# EAGLE design quadcopter (EAGLE 7.6.0)
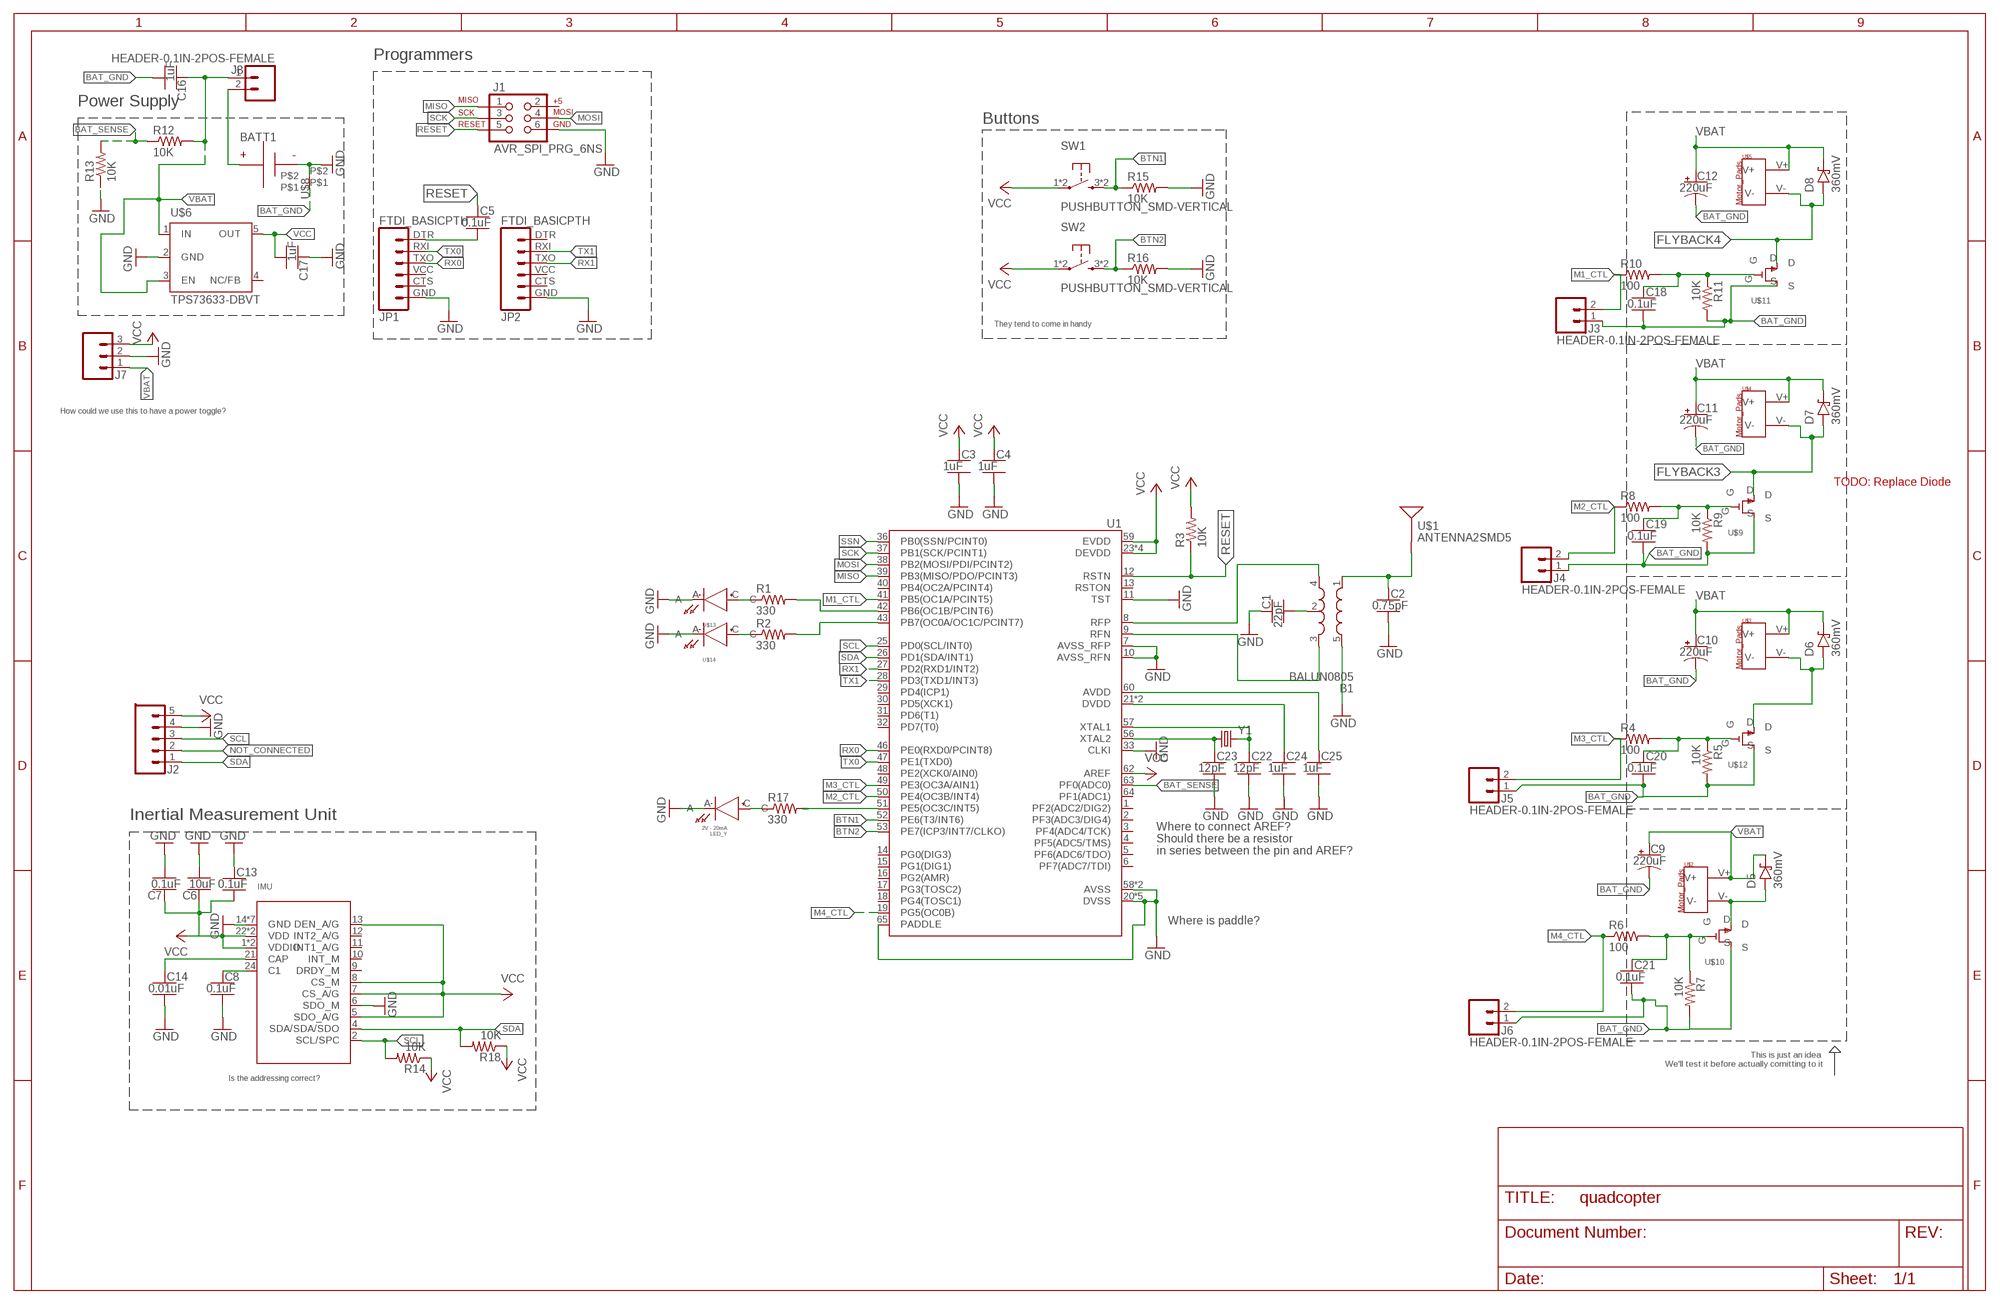
[diagram p0: schematic, sheet 1]

## Parts
B1  BALUN0805  [BALUN]
BATT1  BATTERY-HUBSAN-W/HOLDER  [BATTERY-W/HOLDER-380MAH-HUBSAN]
C1  22pF  CAPACITOR-NP_SMD-2012-0805_CERAMIC-22PF  [CAPC2012X140_HS]
C2  0.75pF  CAPACITOR-NP_SMD-2012-0805_CERAMIC-0.75PF  [CAPC2012X140_HS]
C3  1uF  CAPACITOR-NP_SMD-2012-0805_CERAMIC-1UF  [CAPC2012X140_HS]
C4  1uF  CAPACITOR-NP_SMD-2012-0805_CERAMIC-1UF  [CAPC2012X140_HS]
C5  0.1uF  CAPACITOR-NP_SMD-2012-0805_CERAMIC-0.1UF  [CAPC2012X140_HS]
C6  10uF  CAPACITOR-NP_SMD-2012-0805_CERAMIC-10UF  [CAPC2012X140_HS]
C7  0.1uF  CAPACITOR-NP_SMD-2012-0805_CERAMIC-0.1UF  [CAPC2012X140_HS]
C8  0.1uF  CAPACITOR-NP_SMD-2012-0805_CERAMIC-0.1UF  [CAPC2012X140_HS]
C9  220uF  CAPACITOR-POL_SMD-7043-D_TANTALUM-220UF  [CAPMP7343X310_HS]
C10  220uF  CAPACITOR-POL_SMD-7043-D_TANTALUM-220UF  [CAPMP7343X310_HS]
C11  220uF  CAPACITOR-POL_SMD-7043-D_TANTALUM-220UF  [CAPMP7343X310_HS]
C12  220uF  CAPACITOR-POL_SMD-7043-D_TANTALUM-220UF  [CAPMP7343X310_HS]
C13  0.1uF  CAPACITOR-NP_SMD-2012-0805_CERAMIC-0.1UF  [CAPC2012X140_HS]
C14  0.01uF  CAPACITOR-NP_SMD-2012-0805_CERAMIC-0.01UF  [CAPC2012X140_HS]
C16  1uF  CAPACITOR-NP_SMD-2012-0805_CERAMIC-1UF  [CAPC2012X140_HS]
C17  1uF  CAPACITOR-NP_SMD-2012-0805_CERAMIC-1UF  [CAPC2012X140_HS]
C18  0.1uF  CAPACITOR-NP_SMD-2012-0805_CERAMIC-0.1UF  [CAPC2012X140_HS]
C19  0.1uF  CAPACITOR-NP_SMD-2012-0805_CERAMIC-0.1UF  [CAPC2012X140_HS]
C20  0.1uF  CAPACITOR-NP_SMD-2012-0805_CERAMIC-0.1UF  [CAPC2012X140_HS]
C21  0.1uF  CAPACITOR-NP_SMD-2012-0805_CERAMIC-0.1UF  [CAPC2012X140_HS]
C22  12pF  CAPACITOR-NP_SMD-2012-0805_CERAMIC-12PF  [CAPC2012X140_HS]
C23  12pF  CAPACITOR-NP_SMD-2012-0805_CERAMIC-12PF  [CAPC2012X140_HS]
C24  1uF  CAPACITOR-NP_SMD-2012-0805_CERAMIC-1UF  [CAPC2012X140_HS]
C25  1uF  CAPACITOR-NP_SMD-2012-0805_CERAMIC-1UF  [CAPC2012X140_HS]
D5  360mV  DIODE-SCHOTTKY_SMD-SOD123-360MV  [SOD3716X135_HS]
D6  360mV  DIODE-SCHOTTKY_SMD-SOD123-360MV  [SOD3716X135_HS]
D7  360mV  DIODE-SCHOTTKY_SMD-SOD123-360MV  [SOD3716X135_HS]
D8  360mV  DIODE-SCHOTTKY_SMD-SOD123-360MV  [SOD3716X135_HS]
IMU  IMU  [IMU_LSM9DS1TR]
J1  AVR_SPI_PRG_6NS  [2X3-NS]
J2  HEADER-0.1IN-5POS-FEMALE  [HDRV5W63P254_5X1_1270X254H838_HS]
J3  HEADER-0.1IN-2POS-FEMALE  [HDRV2W63P254_2X1_508X254H838_HS]
J4  HEADER-0.1IN-2POS-FEMALE  [HDRV2W63P254_2X1_508X254H838_HS]
J5  HEADER-0.1IN-2POS-FEMALE  [HDRV2W63P254_2X1_508X254H838_HS]
J6  HEADER-0.1IN-2POS-FEMALE  [HDRV2W63P254_2X1_508X254H838_HS]
J7  HEADER-0.1IN-3POS-MALE  [HDRV3W63P254_3X1_762X254H838_HS]
J8  HEADER-0.1IN-2POS-FEMALE  [HDRV2W63P254_2X1_508X254H838_HS]
JP1  FTDI_BASICPTH  [FTDI_BASIC]
JP2  FTDI_BASICPTH  [FTDI_BASIC]
LED_Y  2V - 20mA  LEDCMD17  [LED_LTST-C170EKT]
R1  330  RESISTOR_SMD-2012-0805-330  [RESC2012X60_HS]
R2  330  RESISTOR_SMD-2012-0805-330  [RESC2012X60_HS]
R3  10K  RESISTOR_SMD-2012-0805-10K  [RESC2012X60_HS]
R4  100  RESISTOR_SMD-2012-0805-100  [RESC2012X60_HS]
R5  10K  RESISTOR_SMD-2012-0805-10K  [RESC2012X60_HS]
R6  100  RESISTOR_SMD-2012-0805-100  [RESC2012X60_HS]
R7  10K  RESISTOR_SMD-2012-0805-10K  [RESC2012X60_HS]
R8  100  RESISTOR_SMD-2012-0805-100  [RESC2012X60_HS]
R9  10K  RESISTOR_SMD-2012-0805-10K  [RESC2012X60_HS]
R10  100  RESISTOR_SMD-2012-0805-100  [RESC2012X60_HS]
R11  10K  RESISTOR_SMD-2012-0805-10K  [RESC2012X60_HS]
R12  10K  RESISTOR_SMD-2012-0805-10K  [RESC2012X60_HS]
R13  10K  RESISTOR_SMD-2012-0805-10K  [RESC2012X60_HS]
R14  10K  RESISTOR_SMD-2012-0805-10K  [RESC2012X60_HS]
R15  10K  RESISTOR_SMD-2012-0805-10K  [RESC2012X60_HS]
R16  10K  RESISTOR_SMD-2012-0805-10K  [RESC2012X60_HS]
R17  330  RESISTOR_SMD-2012-0805-330  [RESC2012X60_HS]
R18  10K  RESISTOR_SMD-2012-0805-10K  [RESC2012X60_HS]
SW1  PUSHBUTTON_SMD-VERTICAL  [TE_FSM8JSMA_HS]
SW2  PUSHBUTTON_SMD-VERTICAL  [TE_FSM8JSMA_HS]
U1  ATMEGA128RFA1  [QFN-64]
U$1  ANTENNA2SMD5  [ANTENNA-CHIP5]
U$2  MOTOR_PADS  [MOTOR_PADS]
U$3  MOTOR_PADS  [MOTOR_PADS]
U$4  MOTOR_PADS  [MOTOR_PADS]
U$5  MOTOR_PADS  [MOTOR_PADS]
U$6  TPS73633-DBVT  [SOT23-DBV]
U$8  NET_BRIDGE  [NET_BRIDGE]
U$9  N-FET  [N_FET_SI2302CDS-T1-E3CT-ND]
U$10  N-FET  [N_FET_SI2302CDS-T1-E3CT-ND]
U$11  N-FET  [N_FET_SI2302CDS-T1-E3CT-ND]
U$12  N-FET  [N_FET_SI2302CDS-T1-E3CT-ND]
U$13  LED-RED  [LED_LTST-C170EKT]
U$14  LED-RED  [LED_LTST-C170EKT]
Y1  CRYSTAL5X3  [CRYSTAL-SMD-5X3]

## Nets
ATTENNA: B1.1(IN) C2.1 U$1.FEED(SIGNAL)
BAT_GND [HighAmps]: C9.2(-) C10.2(-) C11.2(-) C12.2(-) C16.2 C18.2 C19.2 C20.2 C21.2 J3.1 J4.1 J5.1 J6.1 R5.2 R7.2 R9.2 R11.2 U$8.P$1 U$9.S U$10.S U$11.S U$12.S
BAT_SENSE: R12.1 R13.2 U1.63(PF0(ADC0))
BTN1: R15.1 SW1.3 SW1.4 U1.52(PE6(T3/INT6))
BTN2: R16.1 SW2.3 SW2.4 U1.53(PE7(ICP3/INT7/CLKO))
FLYBACK2 [HighAmps]: D6.A U$3.V- U$12.D
FLYBACK3 [HighAmps]: D7.A U$4.V- U$9.D
FLYBACK4 [HighAmps]: D8.A U$5.V- U$11.D
GND: B1.5(GND) BATT1.-(N) C1.1 C2.2 C3.2 C4.2 C6.2 C7.2 C8.2 C13.1 C14.2 C17.1 C22.2 C23.2 C24.2 C25.2 IMU.6(SDO_M) IMU.14(GND) IMU.15(GND) IMU.16(GND) IMU.17(GND) IMU.18(GND) IMU.19(GND) IMU.20(GND) J1.6 J2.4 J7.2 JP1.GND JP2.GND LED_Y.A R13.1 R15.2 R16.2 U1.7(AVSS_RFP) U1.10(AVSS_RFN) U1.11(TST) U1.20(DVSS) U1.24(DVSS) U1.33(CLKI) U1.35(DVSS) U1.45(DVSS) U1.55(DVSS) U1.58(AVSS) U1.61(AVSS) U1.65(PADDLE) U$6.2(GND) U$8.P$2 U$13.A U$14.A
M1_CTL: J3.2 R10.1 U1.41(PB5(OC1A/PCINT5))
M2_CTL: J4.2 R8.1 U1.50(PE4(OC3B/INT4))
M3_CTL: J5.2 R4.1 U1.49(PE3(OC3A/AIN1))
M4_CTL: J6.2 R6.1 U1.19(PG5(OC0B))
MISO: J1.1 U1.39(PB3(MISO/PDO/PCINT3))
MOSI: J1.4 U1.38(PB2(MOSI/PDI/PCINT2))
N$1: C5.2 JP1.DTR
N$2: R2.2 U1.43(PB7(OC0A/OC1C/PCINT7))
N$3: B1.2(GND) C1.2
N$4: R1.2 U1.42(PB6(OC1B/PCINT6))
N$5: R1.1 U$13.C
N$6: R2.1 U$14.C
N$7: D5.A U$2.V- U$10.D
N$8: C20.1 R4.2 R5.1 U$12.G
N$9: C8.1 IMU.24(C1)
N$10 [HighAmps]: BATT1.+(P) J8.2
N$11: C19.1 R8.2 R9.1 U$9.G
N$12: C21.1 R6.2 R7.1 U$10.G
N$13: C18.1 R10.2 R11.1 U$11.G
N$14: C14.1 IMU.21(CAP)
N$15: C22.1 U1.57(XTAL1) Y1.3
N$17: R17.2 U1.51(PE5(OC3C/INT5))
N$18: LED_Y.C R17.1
N$19: C23.1 U1.56(XTAL2) Y1.1
N$20: C24.1 U1.21(DVDD) U1.22(DVDD)
N$21: C25.1 U1.60(AVDD)
NOT_CONNECTED: J2.2
RESET: C5.1 J1.5 R3.1 U1.12(RSTN)
RFN: B1.3(OUT2) U1.9(RFN)
RFP: B1.4(OUT1) U1.8(RFP)
RX0: JP1.TXO U1.46(PE0(RXD0/PCINT8))
RX1: JP2.TXO U1.27(PD2(RXD1/INT2))
SCK: J1.3 U1.37(PB1(SCK/PCINT1))
SCL: IMU.2(SCL/SPC) J2.3 R14.2 U1.25(PD0(SCL/INT0))
SDA: IMU.4(SDA/SDA/SDO) J2.1 R18.2 U1.26(PD1(SDA/INT1))
SSN: U1.36(PB0(SSN/PCINT0))
TX0: JP1.RXI U1.47(PE1(TXD0))
TX1: JP2.RXI U1.28(PD3(TXD1/INT3))
VBAT [HighAmps]: C9.1(+) C10.1(+) C11.1(+) C12.1(+) C16.1 D5.C D6.C D7.C D8.C J7.1 J8.1 R12.2 U$2.V+ U$3.V+ U$4.V+ U$5.V+ U$6.1(IN) U$6.3(EN)
VCC: C3.1 C4.1 C6.1 C7.1 C13.2 C17.2 IMU.1(VDDIO) IMU.3(VDDIO) IMU.5(SDO_A/G) IMU.7(CS_A/G) IMU.8(CS_M) IMU.13(DEN_A/G) IMU.22(VDD) IMU.23(VDD) J2.5 J7.3 R3.2 R14.1 R18.1 SW1.1 SW1.2 SW2.1 SW2.2 U1.23(DEVDD) U1.34(DEVDD) U1.44(DEVDD) U1.54(DEVDD) U1.59(EVDD) U1.62(AREF) U$6.5(OUT)
Unconnected: IMU.9(DRDY_M) IMU.10(INT_M) IMU.11(INT1_A/G) IMU.12(INT2_A/G) J1.2 JP1.CTS JP1.VCC JP2.CTS JP2.DTR JP2.VCC U1.1(PF2(ADC2/DIG2)) U1.2(PF3(ADC3/DIG4)) U1.3(PF4(ADC4/TCK)) U1.4(PF5(ADC5/TMS)) U1.5(PF6(ADC6/TDO)) U1.6(PF7(ADC7/TDI)) U1.13(RSTON) U1.14(PG0(DIG3)) U1.15(PG1(DIG1)) U1.16(PG2(AMR)) U1.17(PG3(TOSC2)) U1.18(PG4(TOSC1)) U1.29(PD4(ICP1)) U1.30(PD5(XCK1)) U1.31(PD6(T1)) U1.32(PD7(T0)) U1.40(PB4(OC2A/PCINT4)) U1.48(PE2(XCK0/AIN0)) U1.64(PF1(ADC1)) U$6.4(NC/FB)

## Notes on the sheet
- Programmers
- Power Supply
- Buttons
- They tend to come in handy
- How could we use this to have a power toggle?
- TODO: Replace Diode
- Inertial Measurement Unit
- Where to connect AREF?
  Should there be a resistor
  in series between the pin and AREF?
- Where is paddle?
- This is just an idea 
  We'll test it before actually comitting to it
- Is the addressing correct?

## Library data of the parts
B1 = quadparts_prebuilt:BALUN: 0805 footprint balun- Ember 351/357; DATASHEET: http://katalog.we-online.de/pbs/datasheet/748421245.pdf; DIST: Digikey; DISTPN: 732-2230-6-ND; MFR: Wurth Electronics Inc; MPN: 748421245; PRICE: 2.63
BATT1 = quadparts_prebuilt:BATTERY; CREATOR: Swanson; DIST: AMAZON; DISTPN: http://www.amazon.com/dp/B00RROB6Q4?smid=AMNTPWSAB5H0S; MFR: HUBSAN; MPN: X4-H107C-8-in-1
C1 = quadparts_prebuilt:CAPACITOR-NP_: Nonpolarized capacitor; DIST: Digikey; DISTPN: 490-5534-1-ND; MFR: Murata Electronics North America; MPN: GRM21A5C2E220JW01D
C2 = quadparts_prebuilt:CAPACITOR-NP_: Nonpolarized capacitor; DIST: Digikey; DISTPN: 490-3585-1-ND; MFR: Murata Electronics North America; MPN: GQM2195C2AR75CB01D
C3 C4 C16 C17 C24 C25 = quadparts_prebuilt:CAPACITOR-NP_: Nonpolarized capacitor; DIST: Digikey; DISTPN: 490-4736-1-ND; MFR: Murata Electronics North America; MPN: GRM21BR71H105KA12L
C5 C7 C8 C13 C18-C21 = quadparts_prebuilt:CAPACITOR-NP_: Nonpolarized capacitor; DIST: Digikey; DISTPN: 490-1666-1-ND; MFR: Murata Electronics North America; MPN: GRM21BR71H104KA01L
C6 = quadparts_prebuilt:CAPACITOR-NP_: Nonpolarized capacitor; DIST: Digikey; DISTPN: 490-5523-1-ND; MFR: Murata Electronics North America; MPN: GRM21BR61E106KA73L
C9-C12 = quadparts_prebuilt:CAPACITOR-POL_: Polarized capacitor; DIST: Digikey; DISTPN: 478-8912-1-ND; MFR: AVX Corporation; MPN: TAJD227K006RNJ
C14 = quadparts_prebuilt:CAPACITOR-NP_: Nonpolarized capacitor; DIST: Digikey; DISTPN: 490-8295-1-ND; MFR: Murata Electronics North America; MPN: GRM2195C1H103FA01D
C22 C23 = quadparts_prebuilt:CAPACITOR-NP_: Nonpolarized capacitor; DIST: Digikey; DISTPN: 490-5531-1-ND; MFR: Murata Electronics North America; MPN: GRM21A5C2E120JW01D
D5-D8 = quadparts_prebuilt:DIODE-SCHOTTKY_: Schottky diode; DIST: Digikey; DISTPN: CRS08QMCT-ND; MFR: Toshiba Semiconductor and Storage; MPN: CRS08(TE85L,Q,M)
IMU = quadparts_michael:IMU; CREATOR: Michael M. Gonzalez; DIST: Digikey; DISTPN: 497-14946-1-ND; MFR: STMicroelectronics; MPN: LSM9DS1TR
J1 = quadparts_prebuilt:AVR_SPI_PRG_6: AVR ISP 6 Pin This is the reduced ISP connector for AVR programming. Common on Arduino. This footprint will take up less PCB space and can be used with a 10-pin to 6-pin adapter such as SKU: BOB-08508; DATASHEET: http://portal.fciconnect.com/Comergent//fci/drawing/67996.pdf; DIST: Digikey; DISTPN: 609-3234-ND; MFR: Amphenol FCI; MPN: 67997-206HLF; PRICE: 0.31
J2 = Components:HEADER-0.1IN-5POS: 5 pin single inline pin header, socket, or connector; DIST: Digikey; DISTPN: S6103-ND; PIN1: 1; PIN2: 2; PIN3: 3; PIN4: 4; PIN5: 5
J3-J6 J8 = Components:HEADER-0.1IN-2POS: 2 pin single inline pin header, socket, or connector; DIST: Digikey; DISTPN: S7000-ND; PIN1: 1; PIN2: 2
J7 = Components:HEADER-0.1IN-3POS: 3 pin single inline pin header, socket, or connector; DIST: Digikey; DISTPN: 3M9448-ND; PIN1: 1; PIN2: 2; PIN3: 3
JP1 JP2 = quadparts_prebuilt:FTDI_BASIC: FTDI Basic header with labels; DATASHEET: http://portal.fciconnect.com/Comergent//fci/drawing/68015.pdf; DIST: Digikey; DISTPN: 609-3327-ND; MFR: Amphenol FCI; MPN: 68016-406HLF; PRICE: 0.33
LED_Y = quadparts_michael:LED; CREATOR: Michael M. Gonzalez; DIST: DIGIKEY; DISTPN: L62507CT-ND; MFR: Visual Communications Company - VCC; MPN: CMD17-21VYD/TR8
R1 R2 R17 = quadparts_prebuilt:RESISTOR_: Resistor; DIST: Digikey; DISTPN: 311-330ARCT-ND; MFR: Yageo; MPN: RC0805JR-07330RL
R3 R5 R7 R9 R11-R16 R18 = quadparts_prebuilt:RESISTOR_: Resistor; DIST: Digikey; DISTPN: 311-10KARCT-ND; MFR: Yageo; MPN: RC0805JR-0710KL
R4 R6 R8 R10 = quadparts_prebuilt:RESISTOR_: Resistor; DIST: Digikey; DISTPN: 311-100ARCT-ND; MFR: Yageo; MPN: RC0805JR-07100RL
SW1 SW2 = quadparts_prebuilt:PUSHBUTTON_: Pushbutton with 2 pins shorting 1 to 2 and two extra mounting pins 3 & 4
U1 = quadparts_prebuilt:ATMEGA128RFA1: ATmega128RFA1 8-bit AVR Microcontroller with Low Power 2.4GHz Transceiver for ZigBee and IEEE 802.15.4; CREATOR: Swanson; DATASHEET: http://www.atmel.com/Images/Atmel-8266-MCU_Wireless-ATmega128RFA1_Datasheet.pdf; DIST: Digikey; DISTPN: ATMEGA128RFA1-ZUR00DKR-ND; MFR: Atmel; MPN: ATMEGA128RFA1-ZUR00; PRICE: 10.21
U$1 = quadparts_prebuilt:ANTENNA2: Chip antenna Single endded antenna. Common with smaller chip antennas. CHIP4 package is the GPS Chip Antenna SKU: GPS-08418. CHIP5 package is 2.4GHz chip antenna SKU: WRL-00144.; DATASHEET: http://www.linxtechnologies.com/resources/data-guides/ant-xxx-chp-x.pdf; DIST: Digikey; DISTPN: ANT-2.45-CHPCT-ND; MFR: Linx Technologies Inc.; MPN: ANT-2.45-CHP-T; PRICE: 3.16
U$2-U$5 = quadparts_prebuilt:MOTOR_PADS; DIST: NA; DISTPN: NA; MFR: NA; MPN: NA
U$6 = quadparts_prebuilt:TPS73633-DBVT; DATASHEET: http://www.ti.com/lit/ds/symlink/lp3985.pdf; DIST: Digikey; DISTPN: LP3985IM5X-3.0/NOPBCT-ND; MFR: Texas Instruments; MPN: LP3985IM5X-3.0/NOPB; PRICE: 0.59
U$8 = quadparts_michael:NET_BRIDGE; CREATOR: Michael Gonzalez; DIST: Nobody; DISTPN: 0; MFR: Digikey; MPN: 0
U$9-U$12 = quadparts_michael:N-FET; CREATOR: Michael M. Gonzalez; DIST: Digikey; DISTPN: SI2302CDS-T1-E3CT-ND; MFR: Vishay Siliconix; MPN: SI2302CDS-T1-E3
U$13 U$14 = quadparts_michael:LED; CREATOR: Michael M. Gonzalez; DIST: Digikey; DISTPN: 160-1178-1-ND; MFR: Lite-On Inc; MPN: LTST-C170EKT
Y1 = quadparts_prebuilt:CRYSTAL: Various standard crystals. Proven footprints.; DATASHEET: http://www.abracon.com/Resonators/abm3b.pdf; DIST: Digikey; DISTPN: 535-9122-1-ND; MFR: Abracon LLC; MPN: ABM3B-16.000MHZ-B2-T; PRICE: 0.68; PROD_ID: XTAL-08218

## Net classes
1 HighAmps: width 0.762 mm
2 RFSIG: width 0.457 mm

## Board
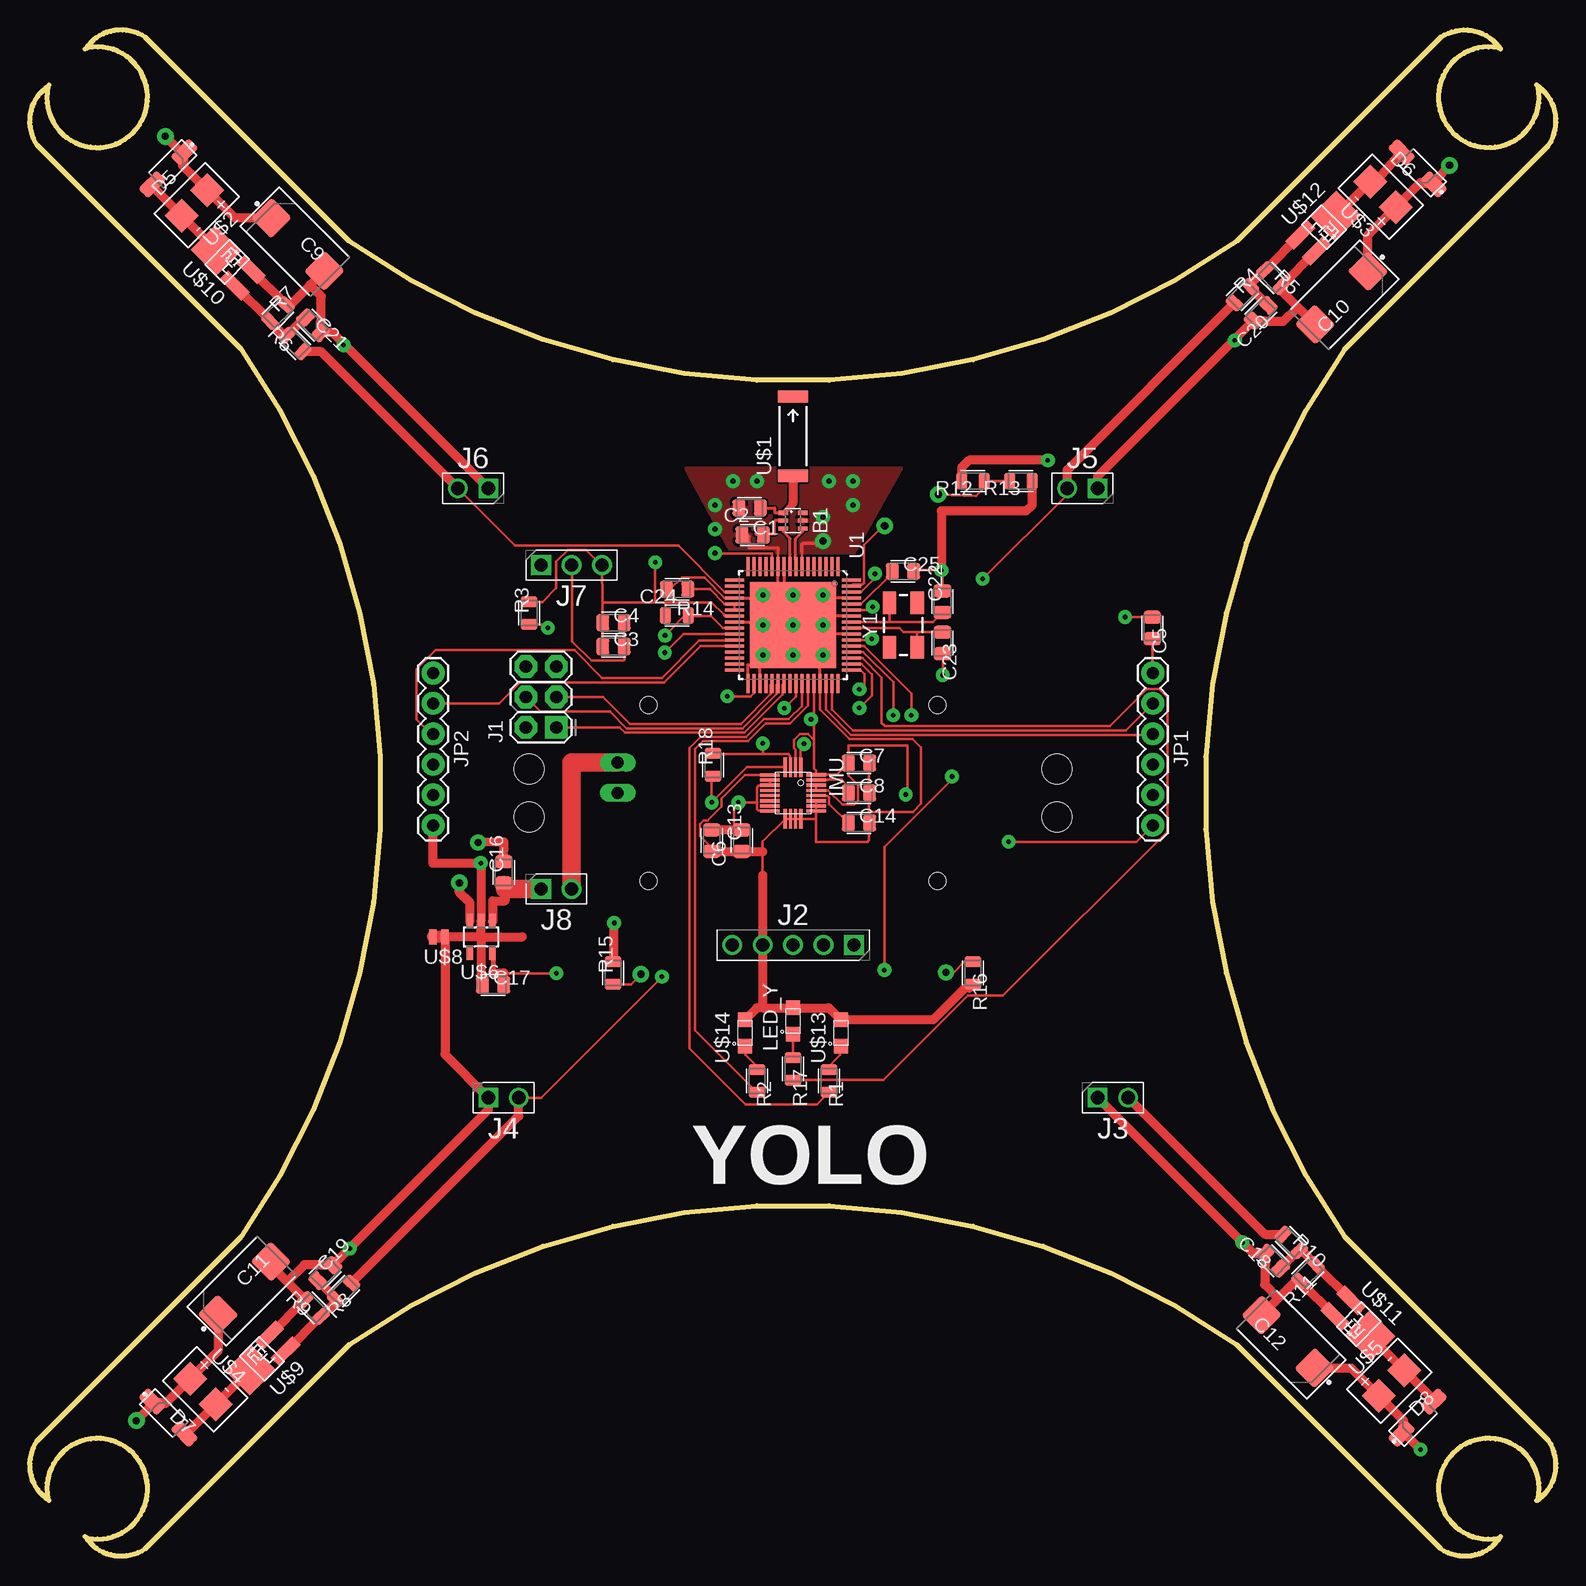
[diagram p1: board, top side]
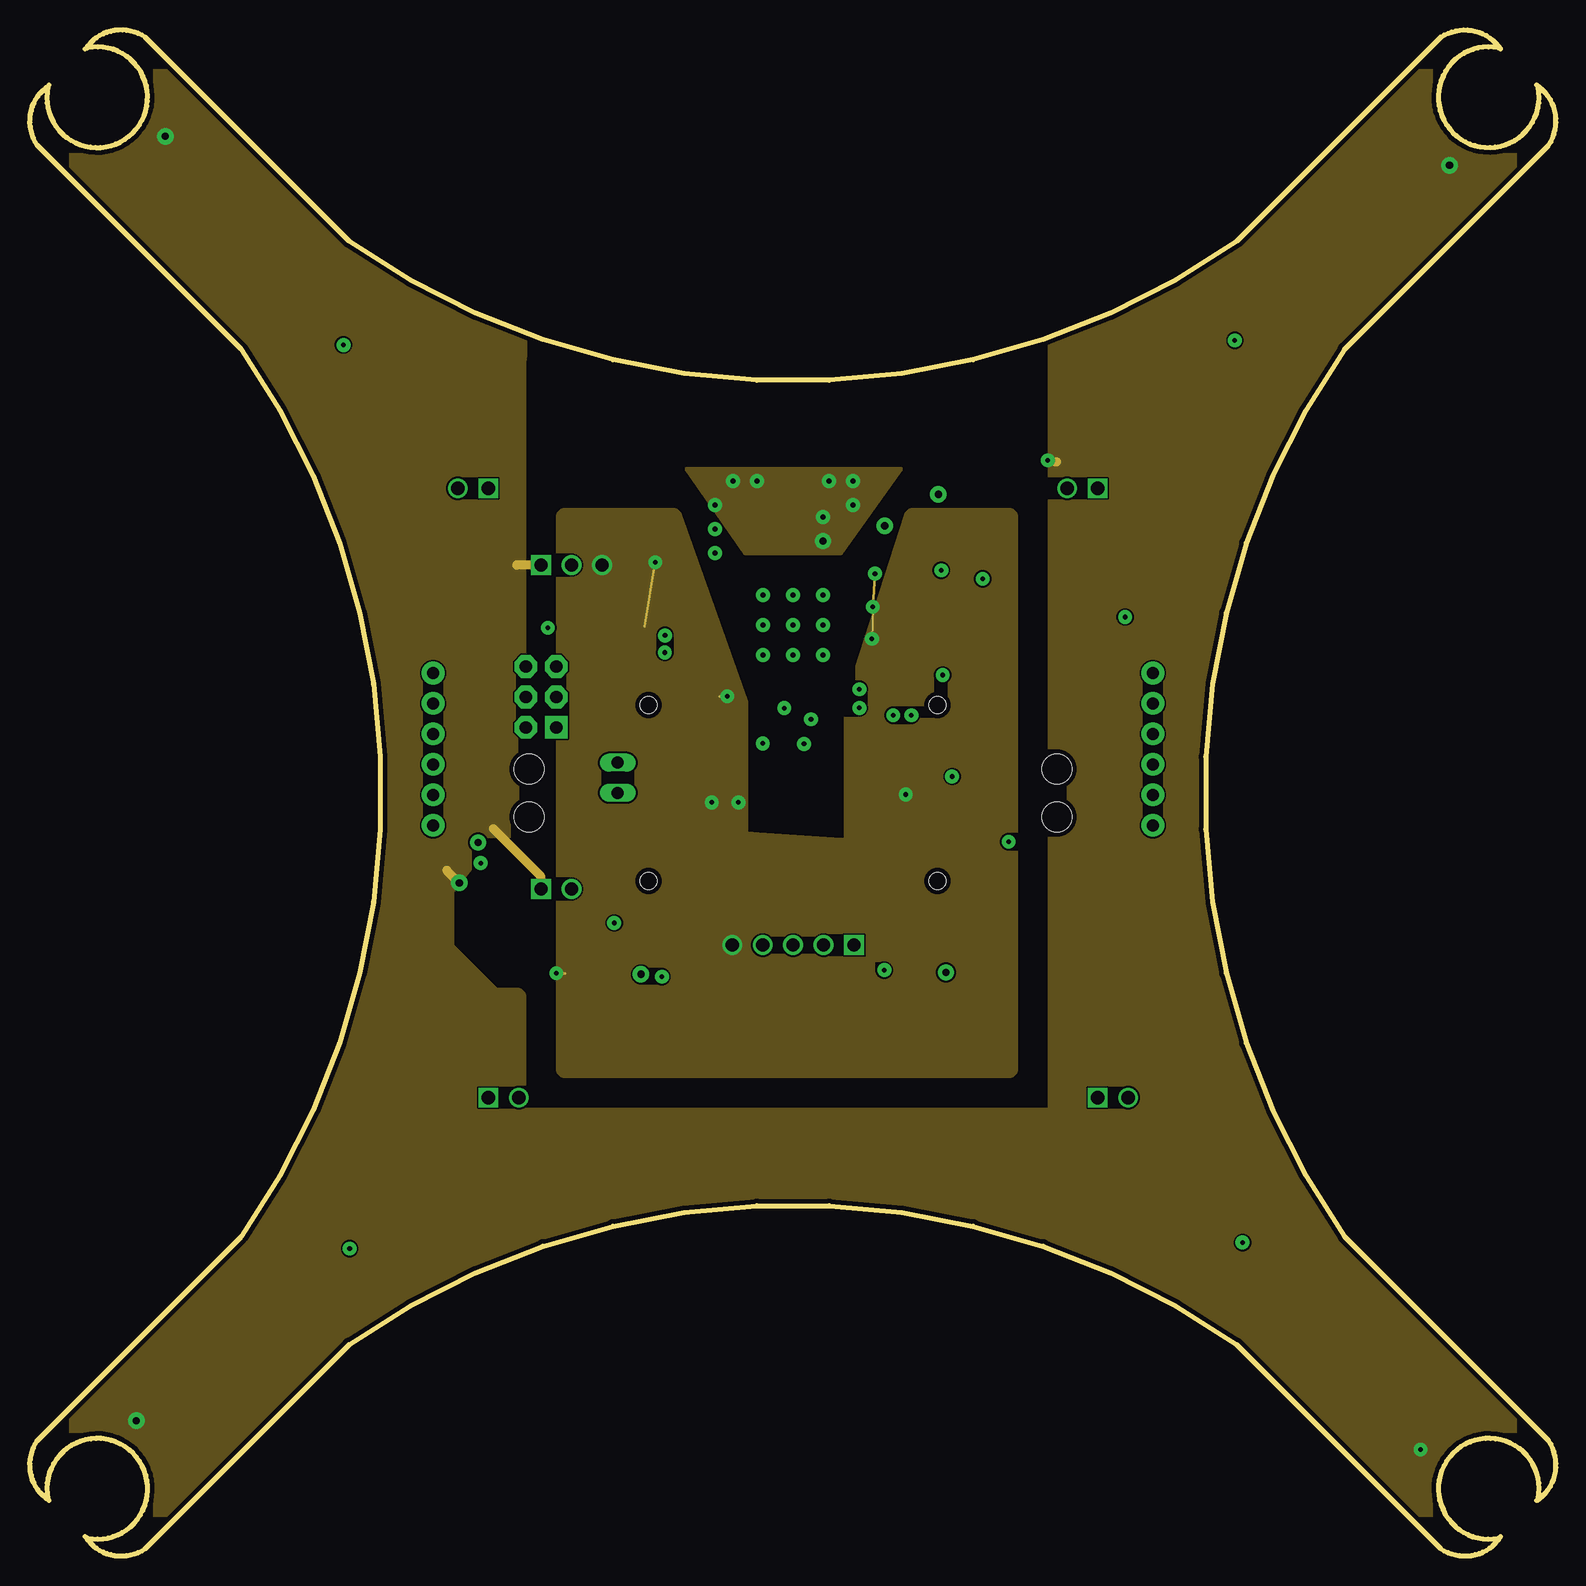
[diagram p2: board, inner layer Route2]
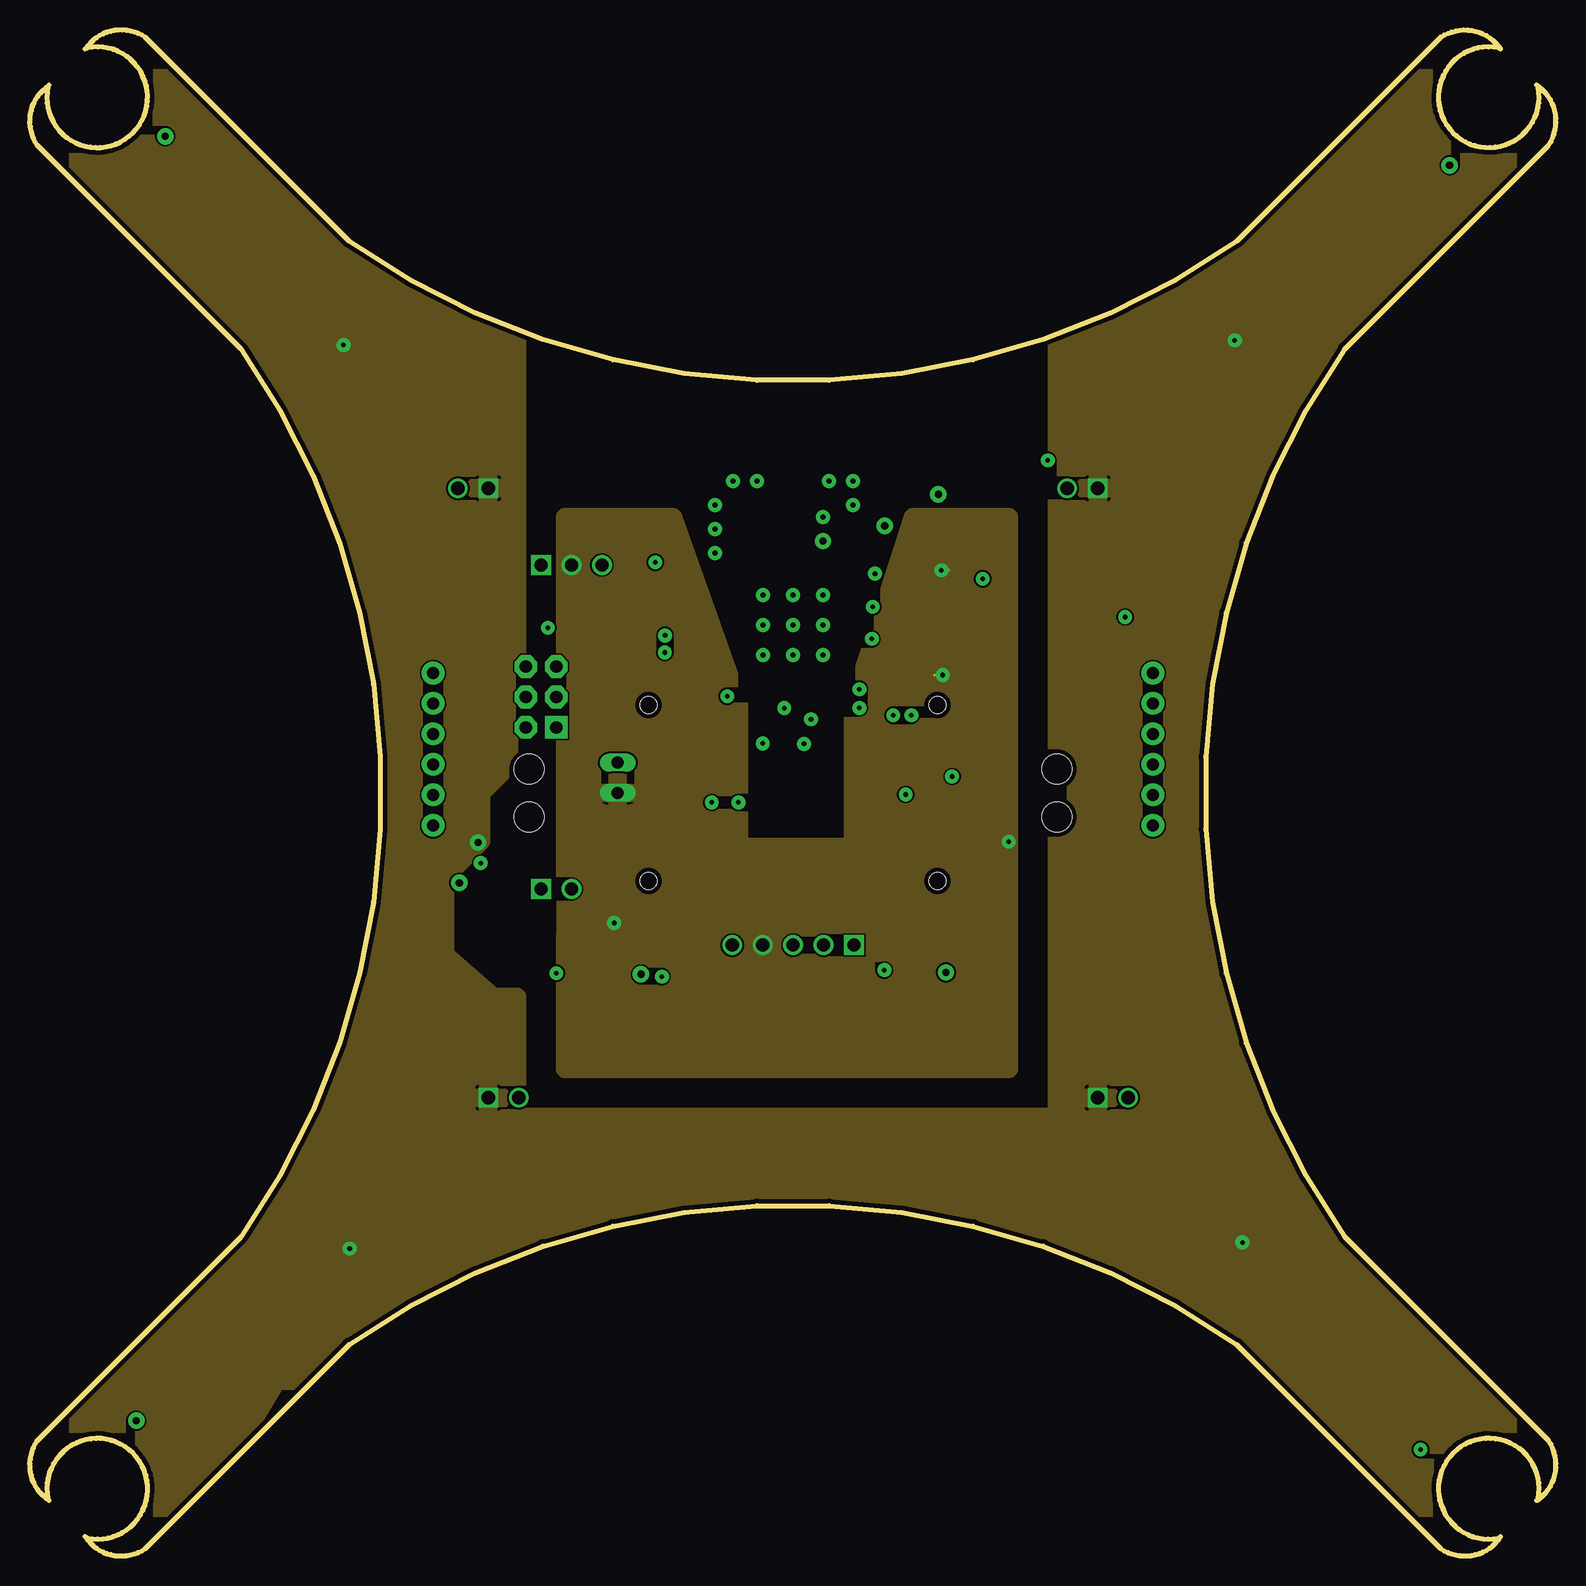
[diagram p3: board, inner layer Route15]
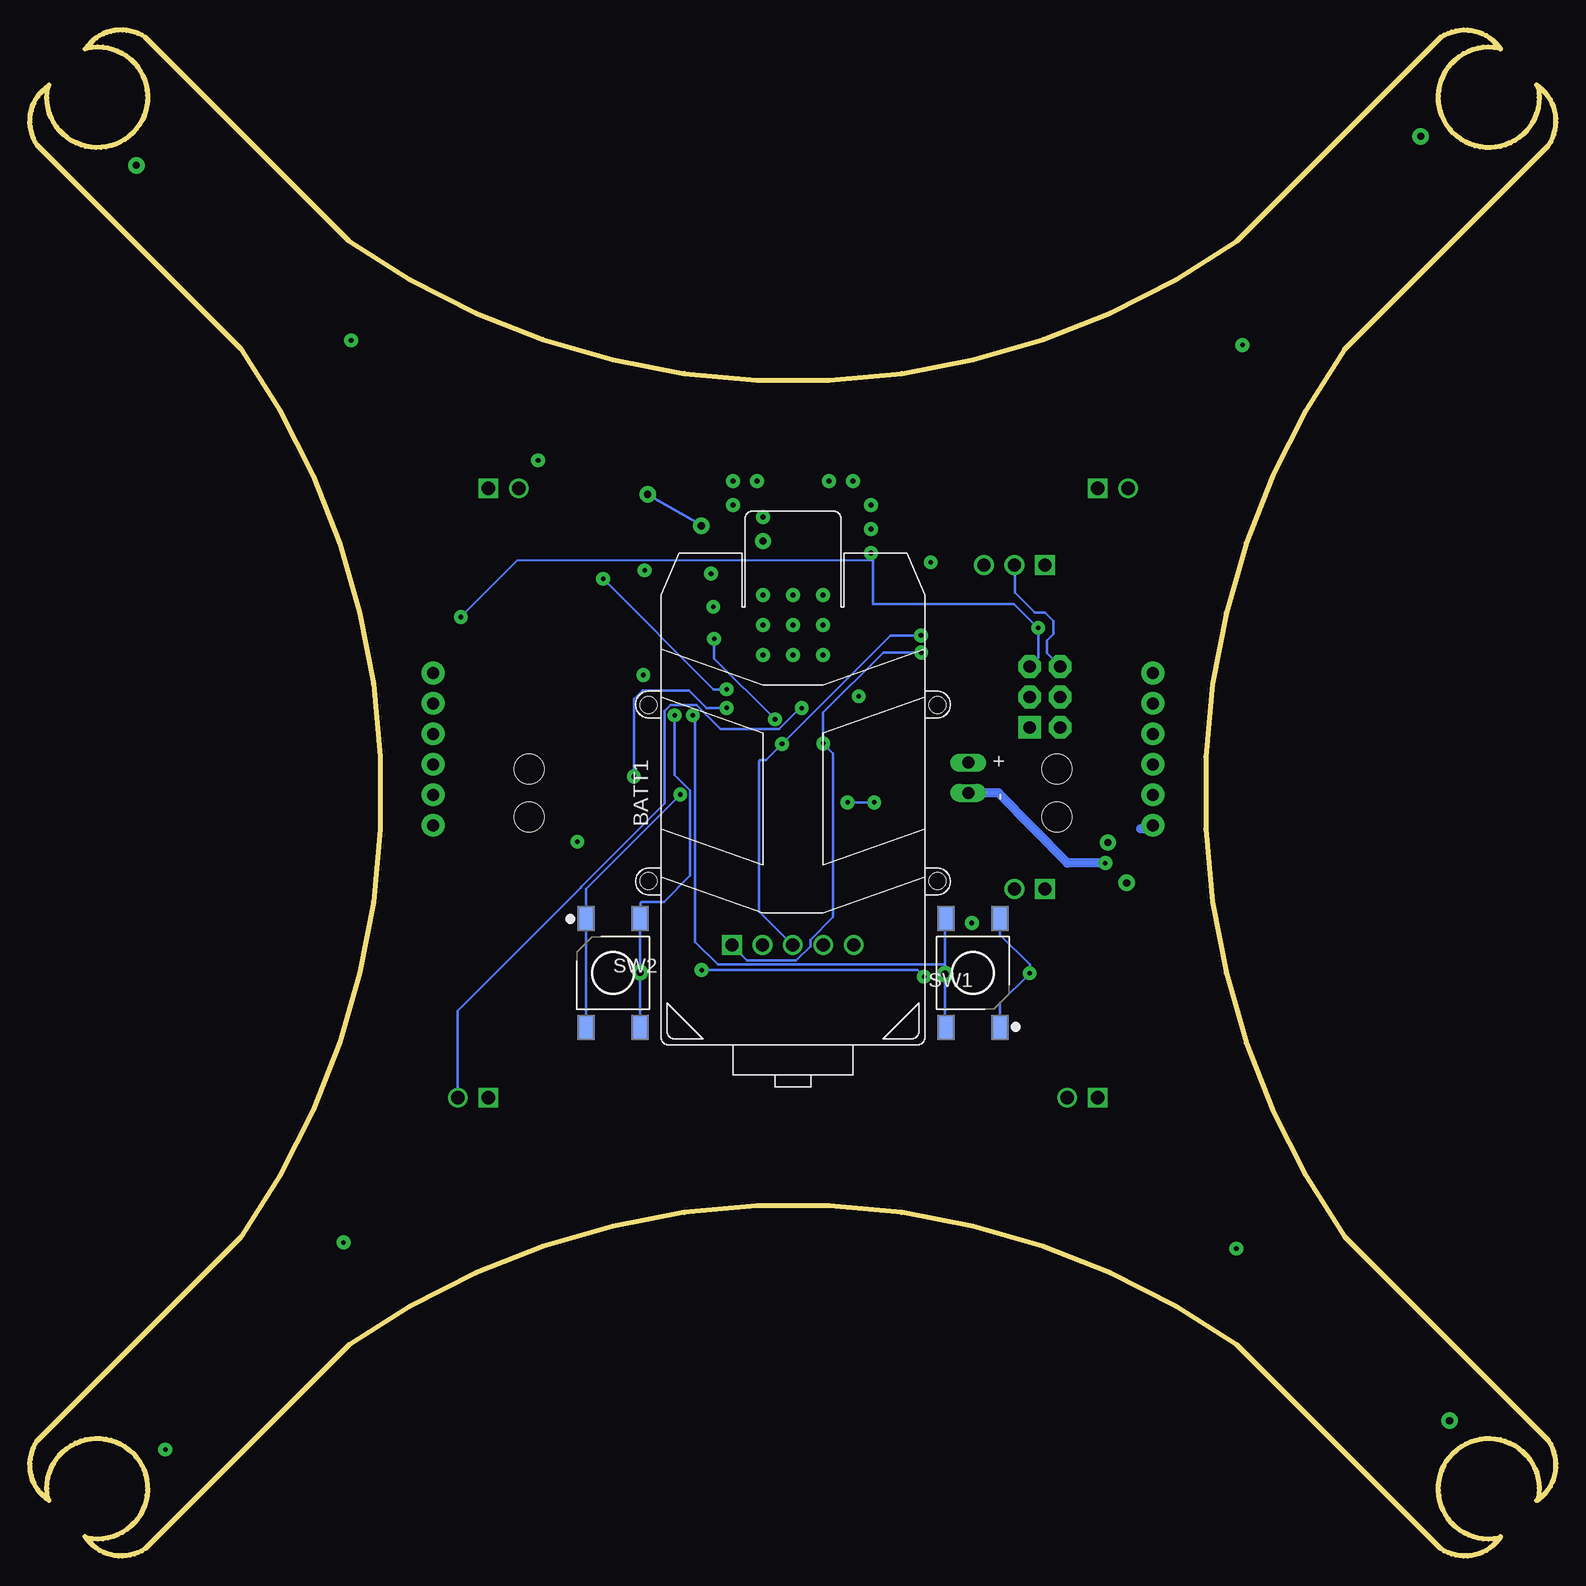
[diagram p4: board, bottom side, seen from below]

Size 127.21 x 127.21 mm. Coordinates in mm from the lower left corner, seen from the top.
Outline: 1.48,122.42 arc292 4.8,125.72
Outline: 1.6,122.6 arc90 0.6,117.6 17.6,100.6 arc-70 17.6,26.6 0.6,9.6 arc90 1.6,4.6
Outline: 4.6,125.6 arc-90 9.6,126.6 26.6,109.6 arc70 100.6,109.6 117.6,126.6 arc-90 122.6,125.6
Outline: 125.72,4.78 arc292 122.4,1.48
Outline: 122.6,1.6 arc-90 117.6,0.6 100.6,17.6 arc70 26.6,17.6 9.6,0.6 arc-90 4.6,1.6
Outline: 125.6,4.6 arc90 126.6,9.6 109.6,26.6 arc-70 109.6,100.6 126.6,117.6 arc90 125.6,122.6
Outline: 122.42,125.72 arc292 125.72,122.4
Outline: 4.78,1.48 arc292 1.48,4.8
Copper layers (1*2*15*16): Top 0.035559375mm / dielectric 1.501140625mm / Route2 0.035559375mm / dielectric 0.149859375mm / Route15 0.035559375mm / dielectric 0.200659375mm / Bottom 0.035559375mm
Design rules "4pcb-66board": minimum track width 6mil, minimum drill 15mil, track to track 6mil, track to pad 6mil, pad to pad 6mil, via to via 6mil, smd to smd 6mil, copper to edge 15mil, drill to drill 10mil, minimum pad ring 10mil, minimum via ring 15mil, stop-mask expansion 4mil, vias tented up to drill 0mil, thermal gap 10mil
Holes 2.5 mm at 41.6,65.6 41.6,61.6 85.6,65.6 85.6,61.6
tRestrict: area 55.6,91.3 to 70.6,97.6
bRestrict: area 55.5,83.8 to 70.6,97.6; area 58.9,73.1 to 68,82.1
vRestrict: area 59.1,73.1 to 68.1,82.1

### Footprints (pad centres in the part's own frame; a part is rotated, then mirrored left to right if it is on the bottom)
BALUN = smd 0.35 x 0.8: 1 -0.65,-0.8; 2 0,-0.8; 3 0.65,-0.8; 4 0.65,0.8; 5 0,0.8; 6 -0.65,0.8
BATTERY-W/HOLDER-380MAH-HUBSAN = drill 1 long: + -2.54,14.605; - 0,14.605 | hole 1.4: -7.35,-12.05; -7.35,12.05; 7.35,-12.05; 7.35,12.05
CAPC2012X140_HS = smd 1.08 x 1.42: 1 -0.895,0; 2 0.895,0
CAPMP7343X310_HS = smd 2.37 x 2.43: 1 -3.12,0; 2 3.12,0
SOD3716X135_HS = smd 2.2 x 1.2: A 1.9,0; C -1.9,0
IMU_LSM9DS1TR = smd 0.27 x 1.65: 1 -1.505,1.935; 6 -1.505,-1.935; 7 -1.075,-1.935; 8 -0.645,-1.935; 9 -0.215,-1.935; 10 0.215,-1.935; 11 0.645,-1.935; 12 1.075,-1.935; 13 1.505,-1.935; 18 1.505,1.935; 19 1.075,1.935; 20 0.645,1.935; 21 0.215,1.935; 22 -0.215,1.935; 23 -0.645,1.935; 24 -1.075,1.935 | smd 1.65 x 0.27: 2 -2.15,0.645; 3 -2.15,0.215; 4 -2.15,-0.215; 5 -2.15,-0.645; 14 2.15,-0.645; 15 2.15,-0.215; 16 2.15,0.215; 17 2.15,0.645
2X3-NS = drill 1.016 pad 1.88 square: 1 -2.54,-1.27 | drill 1.016 pad 1.88 octagon: 2 -2.54,1.27; 3 0,-1.27; 4 0,1.27; 5 2.54,-1.27; 6 2.54,1.27
HDRV5W63P254_5X1_1270X254H838_HS = drill 1.1 pad 1.65 square: 1 0,0 | drill 1.1 pad 1.65: 2 2.54,0; 3 5.08,0; 4 7.62,0; 5 10.16,0
HDRV2W63P254_2X1_508X254H838_HS = drill 1.1 pad 1.65 square: 1 0,0 | drill 1.1 pad 1.65: 2 2.54,0
HDRV3W63P254_3X1_762X254H838_HS = drill 1.1 pad 1.65 square: 1 0,0 | drill 1.1 pad 1.65: 2 2.54,0; 3 5.08,0
FTDI_BASIC = drill 1.016 pad 1.88: CTS 10.16,0; DTR 0,0; GND 12.7,0; RXI 2.54,0; TXO 5.08,0; VCC 7.62,0
LED_LTST-C170EKT = smd 1.2 x 1.2: A 1.1,0; C -1.1,0
RESC2012X60_HS = smd 0.92 x 1.38: 1 -0.955,0; 2 0.955,0
TE_FSM8JSMA_HS = smd 1.4 x 2.1: 1 -2.25,4.55; 2 -2.25,-4.55; 3 2.25,4.55; 4 2.25,-4.55
QFN-64 = smd 1.562 x 0.28: 1 -4.881,3.75; 2 -4.881,3.25; 3 -4.881,2.75; 4 -4.881,2.25; 5 -4.881,1.75; 6 -4.881,1.25; 7 -4.881,0.75; 8 -4.881,0.25; 9 -4.881,-0.25; 10 -4.881,-0.75; 11 -4.881,-1.25; 12 -4.881,-1.75; 13 -4.881,-2.25; 14 -4.881,-2.75; 15 -4.881,-3.25; 16 -4.881,-3.75; 33 4.881,-3.75; 34 4.881,-3.25; 35 4.881,-2.75; 36 4.881,-2.25; 37 4.881,-1.75; 38 4.881,-1.25; 39 4.881,-0.75; 40 4.881,-0.25; 41 4.881,0.25; 42 4.881,0.75; 43 4.881,1.25; 44 4.881,1.75; 45 4.881,2.25; 46 4.881,2.75; 47 4.881,3.25; 48 4.881,3.75 | smd 0.28 x 1.562: 17 -3.75,-4.881; 18 -3.25,-4.881; 19 -2.75,-4.881; 20 -2.25,-4.881; 21 -1.75,-4.881; 22 -1.25,-4.881; 23 -0.75,-4.881; 24 -0.25,-4.881; 25 0.25,-4.881; 26 0.75,-4.881; 27 1.25,-4.881; 28 1.75,-4.881; 29 2.25,-4.881; 30 2.75,-4.881; 31 3.25,-4.881; 32 3.75,-4.881; 49 3.75,4.881; 50 3.25,4.881; 51 2.75,4.881; 52 2.25,4.881; 53 1.75,4.881; 54 1.25,4.881; 55 0.75,4.881; 56 0.25,4.881; 57 -0.25,4.881; 58 -0.75,4.881; 59 -1.25,4.881; 60 -1.75,4.881; 61 -2.25,4.881; 62 -2.75,4.881; 63 -3.25,4.881; 64 -3.75,4.881 | smd 7.15 x 7.15: 65 0,0
ANTENNA-CHIP5 = smd 1.016 x 2.54: FEED -3.302,0; NC 3.302,0
MOTOR_PADS = smd 2 x 2: V+ -1,0; V- 2,0
SOT23-DBV = smd 0.55 x 1.2: 1 -0.95,-1.3; 2 0,-1.3; 3 0.95,-1.3; 4 0.95,1.3; 5 -0.95,1.3
NET_BRIDGE = smd 0.635 x 1.27: P$1 -0.5,0; P$2 0.5,0
N_FET_SI2302CDS-T1-E3CT-ND = smd 3.05 x 2.9: D 1.346,0.25 | smd 2.5 x 1: G -1.846,1.2; S -1.846,-0.7
CRYSTAL-SMD-5X3 = smd 1.9 x 1.1: 1 -1.85,-1.15; 2 1.85,-1.15; 3 1.85,1.15; 4 -1.85,1.15

### Placement (x,y rotation side)
B1  63.6,86.3 270 top
BATT1  63.6,63.6 270 bottom
C1  60.24,85.1 0 top
C2  59.98,87.36 180 top
C3  48.63,75.81 0 top
C4  48.63,77.8 0 top
C5  93.56,77.37 270 top
C6  56.83,59.63 270 top
C7  69.1,66.1 0 top
C8  69.1,63.6 0 top
C9  22.33,109.32 315 top
C10  109.32,104.88 225 top
C11  17.88,22.33 45 top
C12  104.88,17.88 135 top
C13  59.33,59.64 90 top
C14  69.1,61.1 0 top
C16  39.49,56.98 90 top
C17  38.6,47.6 0 top
C18  103.61,24.61 135 top
C19  24.61,23.6 45 top
C20  102.59,103.61 225 top
C21  23.6,102.59 315 top
C22  76.06,79.56 90 top
C23  76.06,76.11 270 top
C24  53.94,80.59 180 top
C25  72.77,82.08 0 top
D5  11.53,115.67 225 top
D6  115.67,115.67 135 top
D7  11.53,11.53 315 top
D8  115.67,11.53 45 top
IMU  63.6,63.6 270 top
J1  42.6,71.6 90 top
J2  68.7,50.92 180 top
J3  89,38.2 0 top
J4  38.2,38.2 0 top
J5  89,89 180 top
J6  38.2,89 180 top
J7  42.6,82.6 0 top
J8  42.6,55.6 0 top
JP1  93.6,73.6 270 top
JP2  33.6,73.6 270 top
LED_Y  63.6,44.6 90 top
R1  66.6,39.6 270 top
R2  60.6,39.6 270 top
R3  41.6,78.6 90 top
R4  101.07,105.13 45 top
R5  103.61,106.53 315 top
R6  22.07,101.07 135 top
R7  20.68,103.61 45 top
R8  26.14,22.07 225 top
R9  23.6,20.68 135 top
R10  105.13,26.14 315 top
R11  106.53,23.6 225 top
R12  78.6,89.6 180 top
R13  82.6,89.6 180 top
R14  53.92,78.38 0 top
R15  48.6,48.6 90 top
R16  78.6,48.6 270 top
R17  63.6,40.6 270 top
R18  56.93,65.94 90 top
SW1  48.6,48.6 180 bottom
SW2  78.6,48.6 0 bottom
U1  63.6,77.6 270 top
U$1  63.6,93.35 90 top
U$2  14.07,113.13 225 top
U$3  113.13,113.13 135 top
U$4  14.07,14.07 315 top
U$5  113.13,14.07 45 top
U$6  37.6,51.6 180 top
U$8  34.1,51.6 180 top
U$9  19.15,16.61 225 top
U$10  16.61,108.05 135 top
U$11  110.59,19.15 315 top
U$12  108.05,110.59 45 top
U$13  67.6,43.6 90 top
U$14  59.6,43.6 90 top
Y1  72.8,77.61 90 top

### Tracks (layer width: path | path; a pad name or v marks a point on that pad's centre or on a via)
ATTENNA
  Top 0.254: C2.1 62.08,87.36 62.08,86.97 62.8,86.97 B1.1
  Top 0.457: B1.1 63.6,87.75
  Top 0.762: U$1.FEED 63.6,87.75
BAT_GND  (via drill 0.38, 0.6)
  Top 0.762: U$9.S 22.9,21.35 R9.2 21.44,22.84 | U$11.S 105.85,22.9 R11.2 105.51,22.92 104.07,21.49 | C11.2 20.09,24.19 21.44,22.84 | 21.44,22.84 22.88,24.28 24.19,24.28 24.23,24.23 C19.2 v26.65,25.63 38.2,37.19 J4.1 34.6,41.81 U$8.P$1 | 104.07,21.49 C12.2 | 104.07,21.49 102.93,22.63 102.93,24.19 102.98,24.23 C18.2 101.96,25.25 v101.07,26.14 J3.1 | 105.67,104.12 C10.2 | 105.67,104.12 104.28,105.51 R5.2 104.3,105.85 U$12.S | 105.67,104.12 104.48,102.93 103.02,102.93 102.97,102.98 C20.2 89,90.02 J5.1 | J6.1 25.25,101.96 C21.2 24.23,102.97 24.28,103.02 24.28,105.01 23.35,105.94 | 23.35,105.94 C9.2 | 23.35,105.94 21.7,104.28 R7.2 21.35,104.3 U$10.S | C16.2 39.51,59.53 v37.35,59.48
  other vias: 26.14,100.94 100.43,101.32
  pour Route15: 40.6,66.6 40.6,114.6 8.6,130.6 -3.4,123.6 18.6,86.6 12.6,46.6 10.6,42.6 15.6,34.6 11.6,32.6 6.6,25.6 -2.4,7.6 8.6,-5.4 20.6,14.6 36.6,14.6 46.6,19.6 74.6,12.6 88.6,10.6 97.6,9.6 119.6,-2.4 130.6,7.6 111.6,30.6 107.6,56.6 104.6,75.6 105.6,80.6 110.6,85.6 118.6,99.6 130.6,116.6 119.6,130.6 96.6,111.6 88.6,107.6 85.6,105.6 85.6,36.6 40.6,36.6 40.6,46.6 38.6,46.6 34.6,50.1 34.6,56.6 37.6,59.6 37.6,63.6
BAT_SENSE  (via drill 0.6)
  Top 0.203: R13.2 R12.1 79.55,89.51 79.55,89.05 78.87,88.37 v75.72,88.5 | U1.63 68.59,80.96 69.37,80.96 69.52,81.11 69.52,84.28 71.19,85.94 | 71.19,85.94 71.27,86.03 | v71.25,85.88 71.19,85.94
  Bottom 0.203: v75.72,88.5 71.4,86.03 v71.25,85.88
BTN1  (via drill 0.38, 0.6)
  Top 0.203: 49.3,47.65 48.62,47.65 R15.1 50.09,47.65 v50.93,48.49 50.93,48.52 | U1.52 69.45,75.35 71.96,72.85 v71.96,70.08
  Bottom 0.203: SW1.3 50.85,44.07 50.85,44.76 50.93,44.83 v50.93,48.49 50.93,49.29 | SW1.4 50.93,53.08 50.93,49.29 | 50.93,49.29 69.86,49.29 71.77,51.2 71.77,69.89 v71.96,70.08
BTN2  (via drill 0.38, 0.6)
  Top 0.203: R16.1 78.59,49.56 77.9,49.56 76.96,48.62 76.35,48.62 v76.35,48.64 | U1.53 69.53,75.85 73.47,71.91 v73.47,70.09
  Bottom 0.203: SW2.4 v76.35,48.64 76.35,53.14 SW2.3 76.32,53.2 76.32,54.45 76.23,54.54 74.35,54.54 72.18,56.71 72.18,63.82 73.47,65.11 v73.47,70.09
FLYBACK2
  Top 0.762: U$12.D 108.89,111.72 U$3.V- 112.19,114.55 D6.A
FLYBACK3
  Top 0.762: U$9.D 18.31,15.48 U$4.V- 13.18,10.36 D7.A
FLYBACK4
  Top 0.762: D8.A 116.85,13.18 U$5.V- 111.72,18.31 U$11.D
GND  (via drill 0.38, 0.6)
  Top 0.152: U$8.P$2 | 76.1,75.21 76.07,75.24 C23.2 | v76.07,73.43 76.1,73.43
  Top 0.203: 62.84,82.47 U1.10 | 69.95,63.6 69.95,66.02 C7.2 | 69.95,62.18 69.95,61.19 C14.2 69.95,61.06 69.95,59.67 69.83,59.54 65.54,59.54 65.54,61.45 | 69.95,62.18 69.95,63.6 | 69.95,63.6 C8.2 | IMU.18 65.54,61.45 | IMU.18 IMU.19 | IMU.18 IMU.20 | 64.26,61.47 IMU.17 | 69.95,62.18 70.11,62.03 73.59,62.03 74.27,62.71 74.27,67.39 73.56,68.1 68.3,68.1 65.85,70.55 U1.45 | U1.55 | 64.34,82.48 U1.7 64.39,82.52 64.37,82.52 64.37,83.67 | U1.20 57.91,79.85 56.22,81.55 54.34,81.55 53.37,80.59 C24.2 | U1.35 | IMU.6 59.62,65.11 57.65,63.14 57.65,62.47 56.49,61.32 56.16,61.32 55.86,61.02 55.86,60.02 56.83,59.06 C6.2 | 49.61,77.71 C4.2 C3.2 49.56,75.78 49.56,74.72 49.47,74.63 46.8,74.63 45.2,76.23 45.2,82.54 J7.2 | U1.24 | JP2.GND 33.64,60.85 | 48.67,49.56 R15.2 48.58,49.56 | 65.54,61.45 IMU.17 | IMU.17 IMU.16 IMU.15 IMU.14 61.08,59.57 61.08,58.73 61.08,56.75 | 68.48,79.83 U1.61 | 76.76,80.44 C22.2 76.06,82.08 v75.97,82.17 73.76,82.17 C25.2 | 76.1,75.21 76.1,73.43 | JP1.GND 92.24,59.54 v81.59,59.54 | 62.33,82.53 62.33,83.8
  Top 0.254: C1.1 59.29,85.07 59.92,85.07 59.92,84.05 62.33,84.05 62.33,83.8 | 62.33,82.53 U1.11 | 65.6,84.22 65.56,84.43 64.37,84.43 64.37,83.67 | 60.89,77.82 v61.1,77.6 | v66.1,77.6 66.84,76.86 66.84,76.85 U1.55 | 66.37,79.83 v66.1,80.1 66.1,79.83 | U1.24 61.1,77.85 v61.1,77.6 | U1.20 60.17,79.85 | 60.17,79.85 60.17,79.86 | U1.11 | 62.35,80.77 61.1,80.77 v61.1,80.1 | 62.87,82.47 62.84,82.47 62.84,80.8 | 60.17,79.85 61.1,79.85 v61.1,80.1 | v61.1,77.6 v61.1,80.1 | U1.35 60.83,72.72 60.83,74.3 | 60.83,74.3 60.83,74.5 61.1,74.5 v61.1,75.1 v61.1,77.6 | v66.1,77.6 U1.65 v63.6,80.1 63.6,80.8 62.84,80.8 | U1.45 65.86,72.72 65.86,74.58 66.1,74.58 v66.1,75.1 | v66.1,75.1 v63.6,75.1 | v66.1,75.1 v66.1,77.6 | 68.48,79.83 66.1,79.83 | U1.58 66.12,78.35 66.12,78.46 66.1,78.46 v66.1,77.6 | 66.1,79.83 v66.1,77.6 | U1.33 59.84,74.3 60.83,74.3 | 62.84,80.8 61.1,80.8 v61.1,80.1 | 62.36,80.77 62.35,80.77 | 62.35,80.77 U1.11
  Top 0.406: U$6.2 37.6,51.6
  Top 0.762: 37.6,51.6 37.6,47.6 C17.1 | 83.54,89.64 R13.1 83.54,89.26 83.54,87.61 83.04,87.1 75.97,87.1 v75.97,82.17 | 61.08,56.75 J2.4 61.08,45.7 | JP2.GND 33.6,57.75 37.6,57.75 | 37.6,51.6 41.06,51.6 | R15.2 48.69,49.65 v48.69,52.77 | U$14.A 60.6,45.7 61.08,45.7 | 61.08,45.7 LED_Y.A 66.6,45.7 U$13.A 75.28,44.7 77.92,47.35 78.3,47.35 R16.2 | 37.6,51.6 U$8.P$2 | 37.6,57.75 U$6.2 | 37.6,51.6 37.6,52.6 | v37.57,57.76 37.6,57.75 | C6.2 56.83,58.75 C13.1 61.08,58.73
  Route15 0.152: v81.59,59.54 81.6,59.9
  Route15 0.203: v75.97,82.17 76.56,82.17 | v76.07,73.43 75.41,73.43 | v48.69,52.77
  Bottom 0.203: J1.6 41.38,74.18 42.45,75.25 42.45,76.32 41.91,76.85 41.91,77.92 42.62,78.63 43.42,78.63 45.11,80.32 45.11,82.54 J7.2
  Bottom 0.762: 34.6,60.6 33.6,60.6 JP2.GND | BATT1.- 46.46,63.6 40.74,57.76 v37.57,57.76
  other vias: 66.1,84.6 66.6,89.6 66.1,86.6 60.6,89.6 57.1,87.6 57.1,85.6 68.6,89.6 58.6,89.6 68.6,87.6 63.6,77.6
  pour Route15: 44.64,54.6 44.6,54.6 44.6,86.6 53.6,86.6 59.1,71.1 59.1,59.1 68.6,59.1 68.6,71.1 73.6,86.6 81.6,86.6 81.6,40.6 44.6,40.6 44.6,51.6 44.64,51.6
  pour Route2: 72.6,90.6 54.73,90.6 59.6,83.6 67.6,83.6
  pour Top: 54.71,90.65 72.62,90.65 68.67,83.67 58.54,83.67
M1_CTL  (via drill 0.38)
  Top 0.203: U1.41 63.85,71.65 v62.88,70.68
  Top 0.762: J3.2 102.93,26.81 R10.1
  Bottom 0.203: J3.2 91.54,45.44 81.26,55.73 81.26,55.77 74.3,62.73 74.3,70.44 73.81,70.92 71.63,70.92 69.64,68.92 64.76,68.92 63.01,70.68 v62.88,70.68
M2_CTL  (via drill 0.38)
  Top 0.203: U1.50 69.3,74.35 70.19,73.47 70.19,71.74 v69.14,70.69 | 41.1,38.38 J4.2 42.6,38.2 v52.68,48.29 | v76.86,64.98 76.86,64.73 71.22,59.09 v71.22,48.85
  Top 0.762: J4.2 40.74,36.68 R8.1
  Bottom 0.203: v69.14,70.69 70.83,70.69 72.27,72.14 76.14,72.14 76.84,71.44 76.84,70.87 76.86,70.79 v76.86,64.98 | 71.2,48.82 v71.22,48.85 53.24,48.85 v52.68,48.29
M3_CTL  (via drill 0.38)
  Top 0.203: 86.11,88.83 J5.2 86.46,88.5 v79.43,81.46 | U1.49 69.23,73.85 69.55,73.53 69.55,72.65 v69.14,72.24
  Top 0.762: J5.2 86.46,90.53 R4.1
  Bottom 0.203: v69.14,72.24 70.21,72.24 v79.43,81.46
M4_CTL
  Top 0.203: U1.19 58.71,80.37 57.9,80.37 54.04,84.23 40.44,84.23 J6.2
  Top 0.762: J6.2 24.27,100.39 R6.1
MISO
  Top 0.203: U1.39 62.75,72.62 62.75,71.83 59.55,68.63 49.59,68.63 49.16,69.06 J1.1
MOSI
  Top 0.203: U1.38 62.25,72.62 62.25,71.83 59.4,68.99 49.74,68.99 48.34,70.39 42.55,70.39 J1.4
N$1
  Top 0.203: C5.2 93.58,76.43 93.58,73.64 JP1.DTR
N$2
  Top 0.203: U1.43 64.85,70.88 63.37,69.39 61.32,69.39 59.84,67.92 56.1,67.92 55.43,67.25 55.43,43.82 R2.2 60.58,38.62
N$3
  Top 0.254: B1.2 62.08,86.3 62.08,85.19 60.5,85.19 C1.2
N$4
  Top 0.203: U1.42 64.34,72.72 64.34,70.87 63.22,69.75 61.17,69.75 59.7,68.28 55.91,68.28 54.97,67.34 54.97,42.32 59.64,37.64 65.6,37.64 R1.2
N$5
  Top 0.203: U$13.C 67.54,42.39 67.54,41.76 66.4,40.62 66.52,40.49 R1.1
N$6
  Top 0.203: U$14.C 59.67,42.39 59.67,41.76 60.81,40.62 60.68,40.49 R2.1
N$7
  Top 0.203: U$10.D 15.48,108.89 | 10.36,114.02 D5.A
  Top 0.762: 15.48,108.89 U$2.V- 10.36,114.02
N$8
  Top 0.203: 101.74,106.02 R4.2 101.74,105.72 | R5.1 102.97,107.2
  Top 0.762: 101.74,106.02 R5.1 | 101.74,105.72 C20.1 | 102.97,107.2 U$12.G
N$9
  Top 0.203: IMU.24 65.56,64.67 66.42,64.67 66.47,64.72 67.64,64.72 68.2,64.16 68.2,63.6 C8.1
N$10
  Top 1.524: BATT1.+ 45.14,66.14 J8.2
N$11
  Top 0.203: 25.46,21.19 R8.2 25.46,21.48 | U$9.G 21.34,17.07
  Top 0.762: 25.46,21.19 R9.1 21.34,17.07 | 25.46,21.48 C19.1
N$12
  Top 0.203: C21.1 22.88,103.23 | R6.2 21.19,101.74 | R7.1 20,102.97
  Top 0.762: 22.88,103.23 R6.2 | 21.19,101.74 R7.1 | 20,102.97 U$10.G
N$13
  Top 0.203: 106.02,25.46 R10.2 105.72,25.46 | R11.1 107.2,24.24
  Top 0.762: 106.02,25.46 R11.1 | 105.72,25.46 C18.1 | 107.2,24.24 U$11.G
N$14
  Top 0.203: IMU.21 65.56,63.36 66.47,63.36 66.62,63.21 66.62,62.69 C14.1
N$15
  Top 0.203: U1.57 71.65,77.85 | 71.65,77.85 Y1.3 | 71.65,77.85 75.26,77.85 C22.1
N$17
  Top 0.203: R17.2 63.6,39.69 71.16,39.69 78.18,46.71 81.12,46.71 94.8,60.39 94.8,71.56 94.1,72.26 93.11,72.26 90.02,69.17 71.27,69.17 70.99,69.45 70.99,73.24 69.38,74.85 U1.51
N$18
  Top 0.203: R17.1 LED_Y.C
N$19
  Top 0.203: U1.56 72.46,77.35 72.8,77.01 73.95,77.01 | 73.95,77.01 Y1.1 | 73.95,77.01 C23.1
N$20
  Top 0.203: C24.1 56.68,80.59 57.91,79.35 U1.21 U1.22
N$21
  Top 0.203: U1.60 69.28,79.35 71.88,81.95 C25.1
RESET  (via drill 0.38)
  Top 0.203: U1.12 61.85,83.55 61.83,83.57 57,83.57 56.94,83.52 v57.1,83.6 | v43.16,77.38 42.89,77.65 41.65,77.65 R3.1 | v91.29,78.27 93.47,78.27 C5.1
  Bottom 0.152: 56.94,82.97 86.62,82.97 91.23,78.37 v91.29,78.27
  Bottom 0.203: J1.5 43.87,74.18 43.16,74.89 v43.16,77.38 43.25,77.38 45.2,79.34 56.94,79.34 56.94,82.97 v57.1,83.6
RFN
  Top 0.254: U1.9 63.37,83.51 63.37,84.81 62.8,85.38 B1.3
RFP
  Top 0.254: U1.8 63.83,83.51 63.83,84.81 64.4,85.38 B1.4
RX0
  Top 0.203: U1.46 66.35,70.55 68.45,68.45 93.53,68.45 JP1.TXO
RX1
  Top 0.203: U1.27 58.71,76.32 55.78,76.32 52.67,73.2 47.69,73.2 45.38,75.52 33.82,75.52 32.22,73.92 32.22,69.74 33.38,68.58 33.56,68.58 JP2.TXO
SCK
  Top 0.203: U1.37 61.75,72.62 61.75,71.84 59.26,69.34 50.01,69.34 47.75,71.6 J1.3
SCL  (via drill 0.38)
  Top 0.203: 64.24,65.76 IMU.2 | IMU.2 64.22,65.78 | U1.25 57.78,77.35 56.77,78.36 54.9,78.36 R14.2 54.58,78.38 v52.94,76.74 | IMU.2 64.25,67.42 v64.52,67.69
  Bottom 0.203: J2.3 63.69,50.98 66.45,53.74 66.45,66.22 66.33,66.34 65.87,66.34 v64.52,67.69 55.48,76.74 v52.94,76.74
SDA  (via drill 0.38)
  Top 0.203: IMU.4 63.36,65.75 63.36,66.68 63.21,66.83 61.09,66.83 | 56.38,66.83 R18.2 57,66.83 61.09,66.83 | U1.26 54.46,76.85 v52.92,75.31 | v61.09,67.73 61.09,66.83
  Bottom 0.203: J2.1 68.67,50.89 67.43,49.65 63.34,49.65 62.15,50.83 62.15,51.37 60.25,53.28 60.25,66.89 v61.09,67.73 61.09,70.3 56.07,75.31 v52.92,75.31
TX0
  Top 0.203: U1.47 66.85,70.55 68.6,68.81 91.35,68.81 JP1.RXI
TX1
  Top 0.203: U1.28 55.9,75.85 52.85,72.8 40.84,72.8 39.11,71.06 JP2.RXI
VBAT  (via drill 0.38, 0.6)
  Top 0.762: U$6.1 38.6,52.9 38.6,54.6 39.6,54.6 39.6,55.6 39.51,56.14 C16.1 39.51,56.31 | 10.39,12.68 D7.C | U$6.3 36.67,52.94 36.67,54.45 35.79,55.32 v35.79,56.11 | v84.85,91.34 78.27,91.34 77.65,90.72 77.65,89.65 R12.2 | D7.C 11.3,12.71 U$4.V+ 15.68,17.09 C11.1 | 10.35,12.71 D7.C | 112.43,12.43 U$5.V+ | C12.1 110.12,15.68 U$5.V+ | U$5.V+ 114.5,11.3 D8.C 114.5,10.3 v115.93,8.87 | D7.C 10.3,12.71 v8.87,11.28 | C10.1 111.53,110.12 U$3.V+ 115.91,114.5 D6.C 118.28,115.93 v118.34,115.93 | C9.1 17.09,111.53 U$2.V+ 12.71,115.91 D5.C 12.71,116.91 v11.28,118.34
  Top 1.524: J8.1 39.6,55.6
  Route2 0.762: v84.85,91.34 85.6,91.19 | J7.1 40.57,82.6 | J8.1 42.6,56.64 38.61,60.63 | v35.79,56.11 34.75,57.15
  Route2 1.524: J8.1 | J7.1
  pour Route2: 40.6,99.6 40.6,60.6 38.6,60.6 34.6,55.6 34.6,50.6 38.6,46.6 40.6,46.6 40.6,36.6 85.6,36.6 85.6,109.6 92.6,109.6 95.6,108.6 117.6,130.6 131.6,120.6 119.6,93.6 107.6,84.6 103.6,78.6 105.6,51.6 106.6,47.6 109.6,34.6 130.6,8.6 119.6,-2.4 102.6,7.6 89.6,12.6 73.6,18.6 45.6,15.6 36.6,12.6 8.6,-3.4 -1.4,6.6 11.6,29.6 9.6,42.6 10.6,53.6 19.6,77.6 15.6,93.6 15.6,95.6 -3.4,120.6 8.6,130.6 38.6,109.6 41.6,106.6
VCC  (via drill 0.38)
  Top 0.203: 68.56,76.3 U1.54 70.08,76.35 v70.18,76.46 | U1.23 58.65,78.34 | 47.73,79.48 J7.3 47.6,82.63 46.36,83.87 44.85,83.87 43.87,82.89 43.87,80.67 42.71,79.52 41.65,79.52 R3.2 | v73,63.48 73.13,63.48 73.13,67.54 68.21,67.54 C7.1 | 65.51,65.13 IMU.1 | C7.1 68.18,66.02 67.29,65.13 65.64,65.13 IMU.1 | 61.57,62.08 IMU.13 61.64,62.12 60.74,62.12 60.59,62.27 60.59,62.82 | IMU.5 59.76,65.75 v56.82,62.82 56.82,64.88 R18.1 | IMU.7 IMU.8 61.64,64.22 60.74,64.22 60.59,64.07 60.59,62.82 | IMU.23 IMU.22 66.53,63.82 67.71,62.64 68.71,62.64 69,62.93 69,64.27 68.21,65.07 C7.1 | U1.59 | U1.44 65.36,69.75 | 65.36,68.15 65.36,65.64 65.53,65.46 65.53,65.2 | 65.36,69.75 65.36,68.15 | 65.53,65.2 65.53,65.08 | U1.23 58.72,78.34 | 47.73,79.48 C4.1 C3.1 | U1.23 58.69,78.39 57.91,78.39 57.84,78.46 56.82,79.48 52.96,79.48 | 52.96,79.48 52.12,79.48 | 52.12,79.48 47.73,79.48 | R14.1 52.97,79.47 52.96,79.48 | U$6.5 38.62,50.36 38.6,50.3 | v43.87,48.58 39.87,48.58 39.5,48.6 | 65.53,65.2 65.56,65.2 IMU.1 | 60.59,62.82 v59.06,62.82 58.7,62.46 58.7,60.54 | 65.36,68.15 65.23,68.15 64.86,68.52 64.18,68.52 63.69,68.03 63.69,67.35 63.82,67.22 IMU.3 | U1.62 68.5,80.34 69.27,80.34 70.44,81.51 v70.44,81.89 | 68.58,78.84 U1.59 | U1.59 70.04,78.85 v70.26,79.12 | v65.1,69.75 65.36,69.75 | U1.34 60.35,71.93 60.05,71.63 58.14,71.63 v58.12,71.66 | 52.12,79.48 v52.12,82.83
  Top 0.406: 38.6,50.3 38.6,48.6
  Top 0.762: 38.6,48.6 39.5,48.6 C17.2 | C6.1 56.83,60.54 58.7,60.54 C13.2
  Route2 0.152: v70.18,76.46 70.26,79.07 v70.26,79.12
  Route2 0.203: v43.87,48.58 44.6,48.58 | v70.44,81.89 v70.26,79.12 | v58.12,71.66 57.48,71.66 | v52.12,82.83 51.23,77.5
  Bottom 0.203: SW2.2 80.85,44.13 80.85,53.11 SW2.1 80.85,53.2 80.85,55.6 73.03,63.43 v73,63.48 | SW1.1 46.36,44.13 46.36,46.09 v43.87,48.58 43.87,49.29 46.36,51.78 46.36,53.11 SW1.2 | v56.82,62.82 v59.06,62.82 | v65.1,69.75 70.18,74.83 v70.18,76.46
  pour Route2: 44.6,86.6 53.6,86.6 59.1,71.1 59.1,59.6 60.1,59.6 67.6,59.1 68.6,59.1 68.6,71.1 73.6,86.6 81.6,86.6 81.6,40.6 44.6,40.6

### Text on the board
tPlace: YOLO
Document: Netbridge, causes some / Missing Soldermask Clearance / violations in DFM check.